# EAGLE design mcu_brd2 (EAGLE 7.7.0)
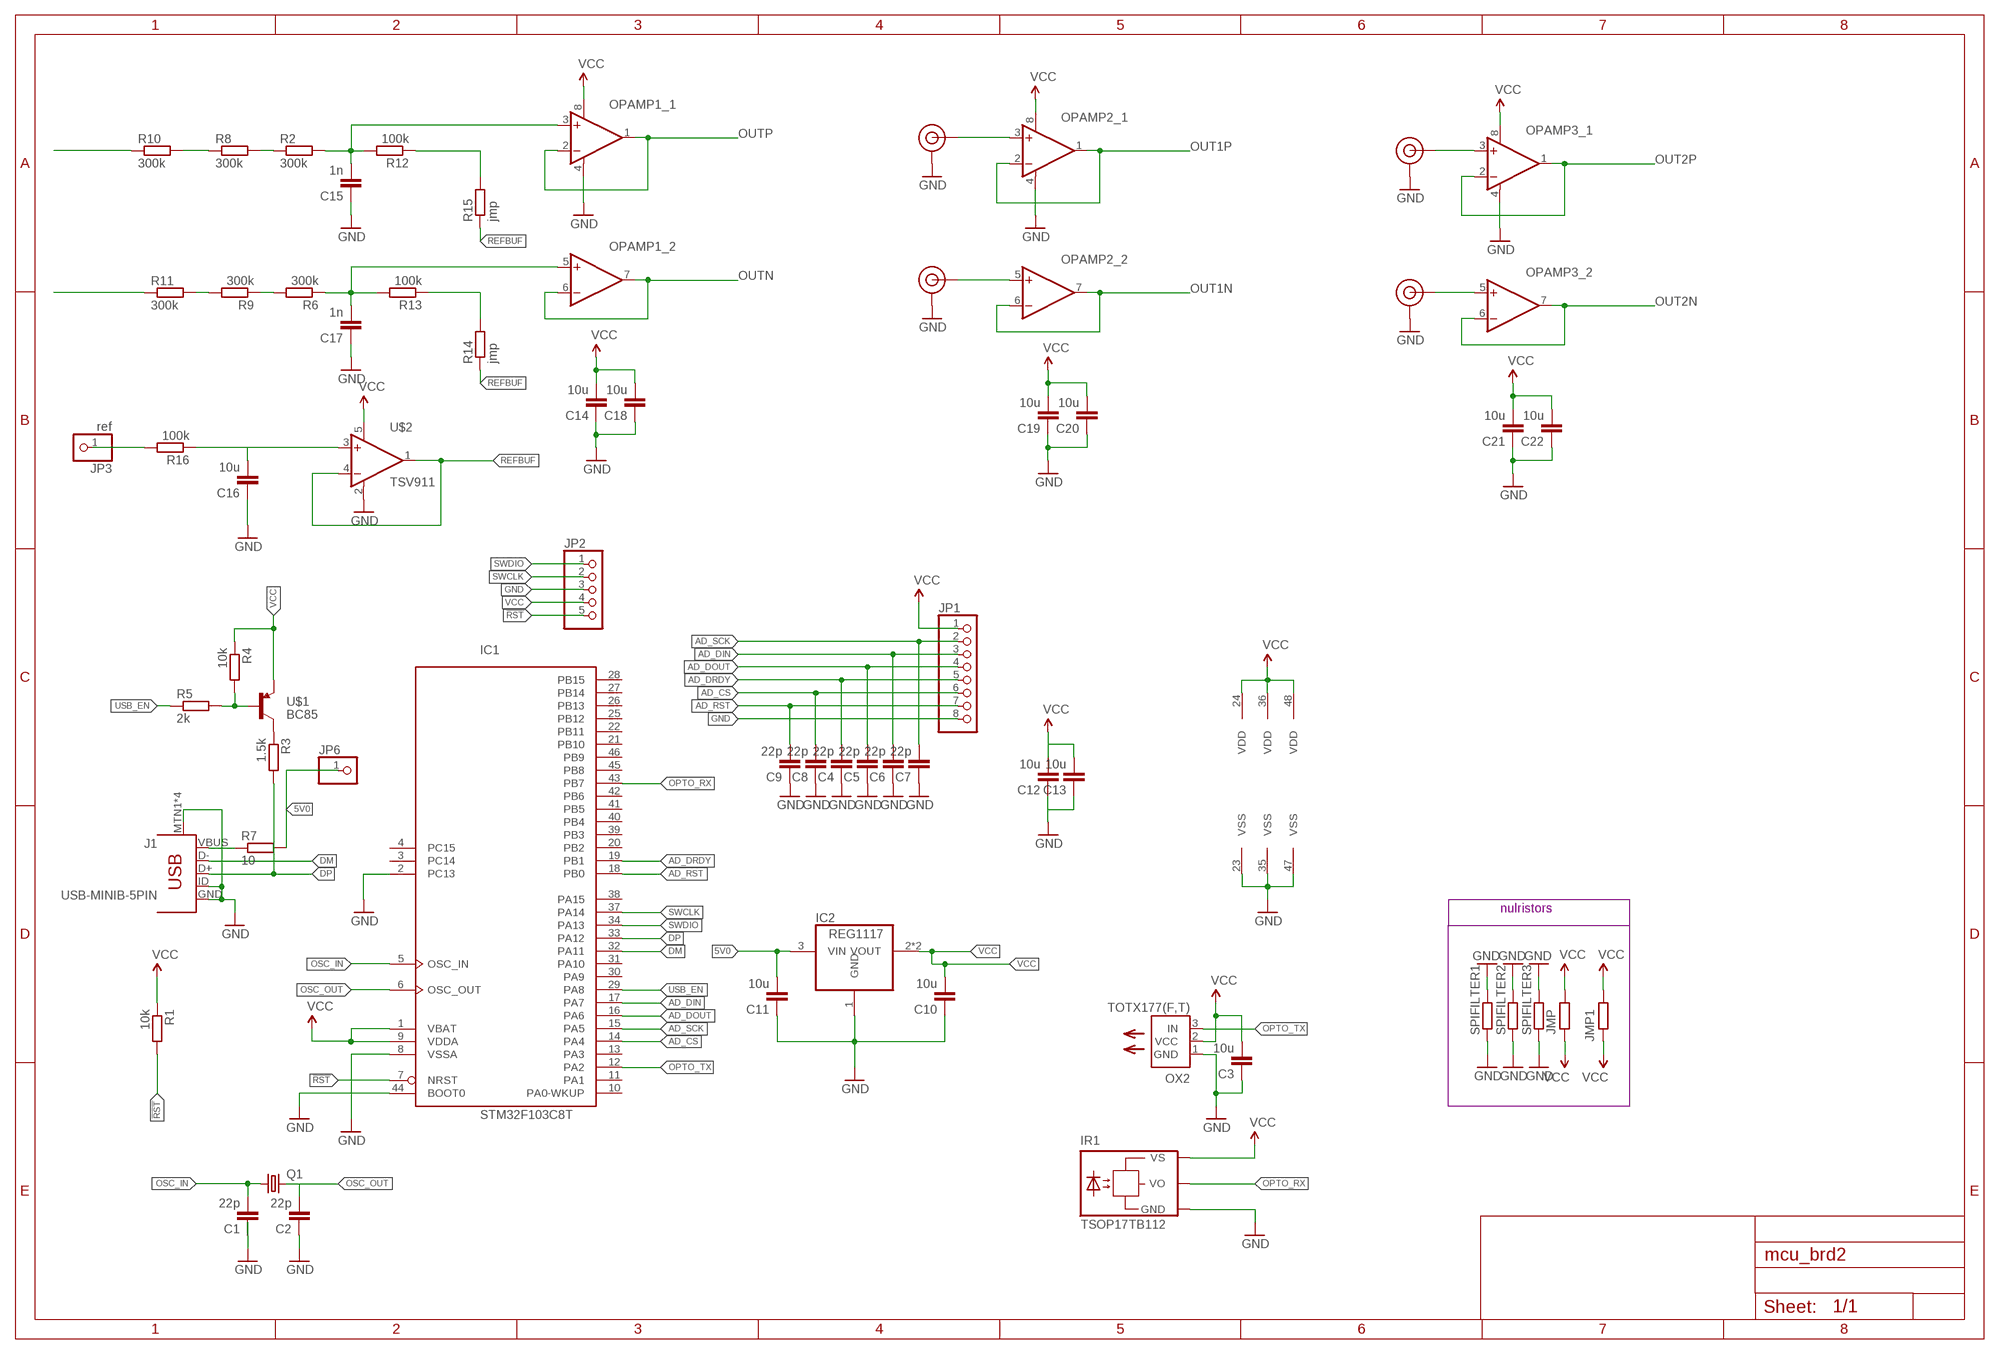
[diagram p0: schematic, sheet 1]

## Parts
C1  22p  CC0603  [C0603]
C2  22p  CC0603  [C0603]
C3  10u  CC0603  [C0603]
C4  22p  CC0603  [C0603]
C5  22p  CC0603  [C0603]
C6  22p  CC0603  [C0603]
C7  22p  CC0603  [C0603]
C8  22p  CC0603  [C0603]
C9  22p  CC0603  [C0603]
C10  10u  CC0805  [C0805]
C11  10u  CC0805  [C0805]
C12  10u  CC0805  [C0805]
C13  10u  CC0805  [C0805]
C14  10u  CC0805  [C0805]
C15  1n  CC0603  [C0603]
C16  10u  CC0805  [C0805]
C17  1n  CC0603  [C0603]
C18  10u  CC0805  [C0805]
C19  10u  CC0805  [C0805]
C20  10u  CC0805  [C0805]
C21  10u  CC0805  [C0805]
C22  10u  CC0805  [C0805]
IC1  STM32F103C8T  [LQFP48]
IC2  REG1117  [SOT223]
IR1  TSOP17TB112  [1X03]
J1  USB-MINIB-5PIN  [USB-MINIB]
J$1  SMA_EDGE  [SMA-EDGE]
J$2  SMA_EDGE  [SMA-EDGE]
J$3  SMA_EDGE  [SMA-EDGE]
J$4  SMA_EDGE  [SMA-EDGE]
JMP  R0603  [0603]
JMP1  R0603  [0603]
JP1  PINHD-1X8  [1X08]
JP2  PINHD-1X5  [1X05]
JP3  ref  PINHD-1X01_2.00  [1X01M]
JP6  PINHD-1X1  [1X01]
OPAMP1  LMC662  [SO08]
OPAMP2  LMC662  [SO08]
OPAMP3  LMC662  [SO08]
OX2  TOTX177(F,T)  [TOTX]
Q1  CRYSTALHC49UP  [HC49UP]
R1  10k  R0603  [0603]
R2  300k  R0603  [0603]
R3  1.5k  R0603  [0603]
R4  10k  R0603  [0603]
R5  2k  R0603  [0603]
R6  300k  R0603  [0603]
R7  10  R0805  [R0805]
R8  300k  R0603  [0603]
R9  300k  R0603  [0603]
R10  300k  R0603  [0603]
R11  300k  R0603  [0603]
R12  100k  R0603  [0603]
R13  100k  R0603  [0603]
R14  jmp  R0603  [0603]
R15  jmp  R0603  [0603]
R16  100k  R0603  [0603]
SPIFILTER1  R0603  [0603]
SPIFILTER2  R0603  [0603]
SPIFILTER3  R0603  [0603]
U$1  BC85  [SOT23]
U$2  TSV911  [SOT23-5L]

## Nets
5V0: C11.2 IC2.3(VIN) JP6.1 R7.2
!RST: IC1.7(NRST) JP2.5 R1.2
AD_CS: C8.2 IC1.14(PA4) JP1.6
AD_DIN: C6.2 IC1.17(PA7) JP1.3
AD_DOUT: C5.2 IC1.16(PA6) JP1.4
AD_DRDY: C4.2 IC1.19(PB1) JP1.5
AD_RST: C9.2 IC1.18(PB0) JP1.7
AD_SCK: C7.2 IC1.15(PA5) JP1.2
DM: IC1.32(PA11) J1.D-
DP: IC1.33(PA12) J1.D+ R3.2
GND: C1.1 C2.1 C3.1 C4.1 C5.1 C6.1 C7.1 C8.1 C9.1 C10.1 C11.1 C12.1 C13.1 C14.1 C15.1 C16.1 C17.1 C18.1 C19.1 C20.1 C21.1 C22.1 IC1.2(PC13) IC1.8(VSSA) IC1.23(VSS) IC1.35(VSS) IC1.44(BOOT0) IC1.47(VSS) IC2.1(GND) IR1.3(GND) J1.GND J1.ID J1.MTN1 J1.MTN2(MTN1) J1.MTN3(MTN1) J1.MTN4(MTN1) J$1.GND@0(GND) J$1.GND@1(GND) J$1.GND@2(GND) J$1.GND@3(GND) J$2.GND@0(GND) J$2.GND@1(GND) J$2.GND@2(GND) J$2.GND@3(GND) J$3.GND@0(GND) J$3.GND@1(GND) J$3.GND@2(GND) J$3.GND@3(GND) J$4.GND@0(GND) J$4.GND@1(GND) J$4.GND@2(GND) J$4.GND@3(GND) JP1.8 JP2.3 OPAMP1.4(_1:V-) OPAMP2.4(_1:V-) OPAMP3.4(_1:V-) OX2.1(GND) SPIFILTER1.1 SPIFILTER1.2 SPIFILTER2.1 SPIFILTER2.2 SPIFILTER3.1 SPIFILTER3.2 U$2.2(V-)
N$1: J$2.SIG(SIGNAL) OPAMP2.5(_2:+IN)
N$2: J$1.SIG(SIGNAL) OPAMP2.3(_1:+IN)
N$3: R3.1 U$1.3(C)
N$4: R4.2 R5.2 U$1.1(B)
N$5: J$4.SIG(SIGNAL) OPAMP3.5(_2:+IN)
N$6: C17.2 OPAMP1.5(_2:+IN) R6.1 R13.2
N$7: J$3.SIG(SIGNAL) OPAMP3.3(_1:+IN)
N$8: R12.1 R15.2
N$10: C15.2 OPAMP1.3(_1:+IN) R2.2 R12.2
N$11: R10.1
N$12: R6.2 R9.1
N$13: R2.1 R8.2
N$14: R9.2 R11.2
N$15: R11.1
N$16: R8.1 R10.2
N$17: JP3.1 R16.2
N$18: R13.1 R14.2
N$19: C16.2 R16.1 U$2.3(+IN)
OPTO_RX: IC1.43(PB7) IR1.1(VO)
OPTO_TX: IC1.12(PA2) OX2.3(IN)
OSC_IN: C1.2 IC1.5(OSC_IN) Q1.1
OSC_OUT: C2.2 IC1.6(OSC_OUT) Q1.2
OUT1N: OPAMP2.6(_2:-IN) OPAMP2.7(_2:OUT)
OUT1P: OPAMP2.1(_1:OUT) OPAMP2.2(_1:-IN)
OUT2N: OPAMP3.6(_2:-IN) OPAMP3.7(_2:OUT)
OUT2P: OPAMP3.1(_1:OUT) OPAMP3.2(_1:-IN)
OUTN: OPAMP1.6(_2:-IN) OPAMP1.7(_2:OUT)
OUTP: OPAMP1.1(_1:OUT) OPAMP1.2(_1:-IN)
REFBUF: R14.1 R15.1 U$2.1(OUT) U$2.4(-IN)
SWCLK: IC1.37(PA14) JP2.2
SWDIO: IC1.34(PA13) JP2.1
USB_EN: IC1.29(PA8) R5.1
VBUS: J1.VBUS R7.1
VCC: C3.2 C10.2 C12.2 C13.2 C14.2 C18.2 C19.2 C20.2 C21.2 C22.2 IC1.1(VBAT) IC1.9(VDDA) IC1.24(VDD) IC1.36(VDD) IC1.48(VDD) IC2.2(VOUT) IC2.4(VOUT) IR1.2(VS) JMP1.1 JMP1.2 JMP.1 JMP.2 JP1.1 JP2.4 OPAMP1.8(_1:V+) OPAMP2.8(_1:V+) OPAMP3.8(_1:V+) OX2.2(VCC) R1.1 R4.1 U$1.2(E) U$2.5(V+)
Unconnected: IC1.3(PC14) IC1.4(PC15) IC1.10(PA0-WKUP) IC1.11(PA1) IC1.13(PA3) IC1.20(PB2) IC1.21(PB10) IC1.22(PB11) IC1.25(PB12) IC1.26(PB13) IC1.27(PB14) IC1.28(PB15) IC1.30(PA9) IC1.31(PA10) IC1.38(PA15) IC1.39(PB3) IC1.40(PB4) IC1.41(PB5) IC1.42(PB6) IC1.45(PB8) IC1.46(PB9)

## Notes on the sheet
- nulristors

## Library data of the parts
C1-C22 = smalsmd:C: Capacitor
IC1 = micro-stm_v3:STM32F103C*T: ARM 32-bit Cortex™-M3 CPU 72 MHz maximum frequency 16 to 128 Kbytes of Flash memory 6 to 20 kbytes of SRAM 37 GPIOs 2.0 to 3.6 V application supply
IC2 = burr-brown:REG1117: 800mA and 1A Low Dropout (LDO) Positive Regulator 1.8V, 2.5V, 2.85V, 3.3V, 5V, and Adj; MPN: REG1117; OC_FARNELL: 1097566; OC_NEWARK: 14P6981
IR1 = telefunken:TSOP17*TB1: TSOP17..TB1 IR Receiver Modules for Remote Control Systems Source: http://www.vishay.com/docs/82042/82042.pdf
J1 = SparkFun-Connectors:USB-MINIB: Mini-USB "B" connector with 5th pin broken out. Created new symbol breaking out 5th "ID" pin in mini/micro USB connector spec. See: http://en.wikipedia.org/wiki/Mini_usb#Cables. Uses same footprint as 4-pin symbol. Also added pins to connect to mounting / shield pads if required (probably not generally needed as signals aren't shielded once they leave the connector).; PROD_ID: CONN-08193
J$1-J$4 = SparkFun-Connectors:SMA_EDGE: SMA Antenna Connector End launch SMA connector. The paste layer has been removed so that the connector can be hand soldered onto the board after reflow.
JMP JMP1 R1-R16 SPIFILTER1-SPIFILTER3 = smalsmd:R
JP1 = pinhead:PINHD-1X8: PIN HEADER
JP2 = pinhead:PINHD-1X5: PIN HEADER
JP3 = pinhead-2:PINHD-1X01: PIN HEADER
JP6 = pinhead:PINHD-1X1: PIN HEADER
OPAMP1-OPAMP3 = OU:LMC662
OX2 = toslink:TOTX177(F,T): FIBER OPTIC TRANSMITTING MODULE
Q1 = crystal:CRYSTAL: CRYSTAL; OC_FARNELL: unknown; OC_NEWARK: unknown
U$1 = smalsmd:BC85*
U$2 = OU:TSV911

## Board
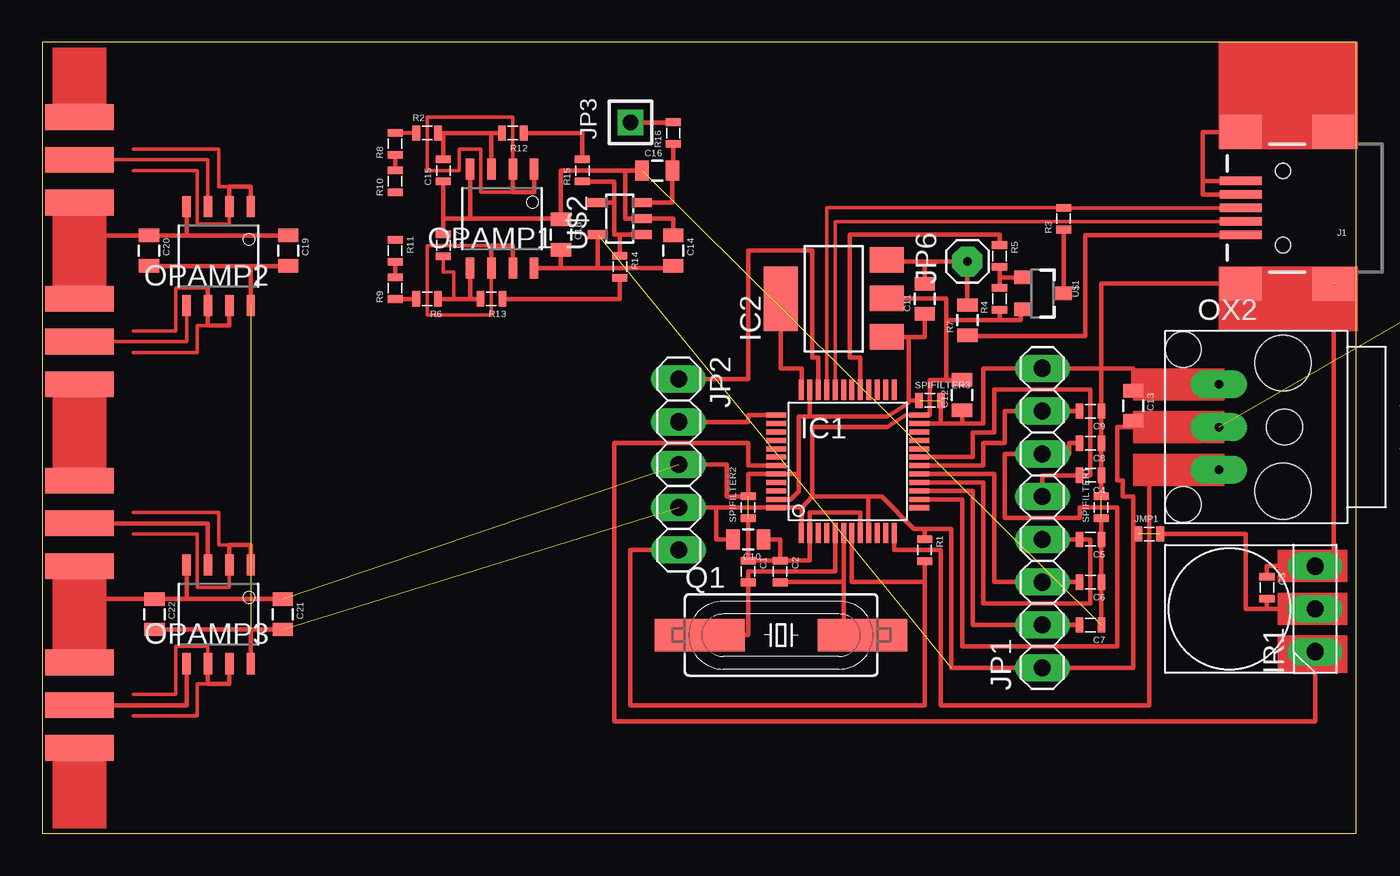
[diagram p1: board, top side]
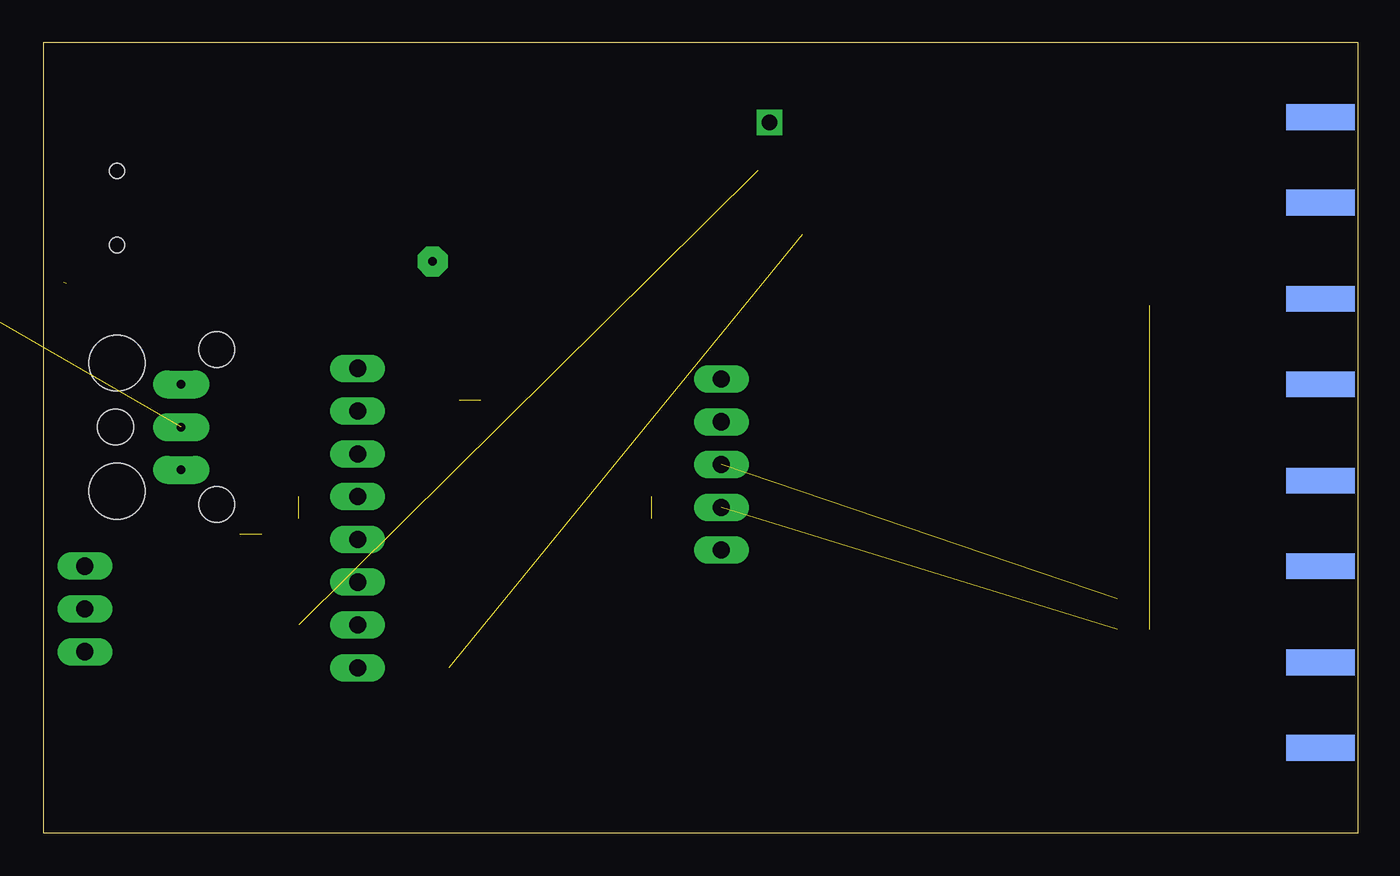
[diagram p2: board, bottom side, seen from below]

Size 78 x 47 mm. Coordinates in mm from the lower left corner, seen from the top.
Outline: 0,0 78,0 78,47 0,47 0,0
Copper layers (1*16): Top 0.035mm / dielectric 1.5mm / Bottom 0.035mm
Design rules "SparkFun": minimum track width 8mil, minimum drill 20mil, track to track 8mil, track to pad 8mil, pad to pad 8mil, via to via 8mil, smd to smd 8mil, copper to edge 10mil, drill to drill 8mil, minimum pad ring 12mil, minimum via ring 10mil, stop-mask expansion 4mil, vias tented up to drill 25mil, thermal gap 10mil

### Footprints (pad centres in the part's own frame; a part is rotated, then mirrored left to right if it is on the bottom)
C0603 = smd 0.45 x 0.9: 1 -0.65,0; 2 0.65,0
C0805 = smd 0.8 x 1.2: 1 -0.9,0; 2 0.9,0
LQFP48 = smd 0.3 x 1.2: 1 -2.75,-4.25; 2 -2.25,-4.25; 3 -1.75,-4.25; 4 -1.25,-4.25; 5 -0.75,-4.25; 6 -0.25,-4.25; 7 0.25,-4.25; 8 0.75,-4.25; 9 1.25,-4.25; 10 1.75,-4.25; 11 2.25,-4.25; 12 2.75,-4.25; 25 2.75,4.25; 26 2.25,4.25; 27 1.75,4.25; 28 1.25,4.25; 29 0.75,4.25; 30 0.25,4.25; 31 -0.25,4.25; 32 -0.75,4.25; 33 -1.25,4.25; 34 -1.75,4.25; 35 -2.25,4.25; 36 -2.75,4.25 | smd 1.2 x 0.3: 13 4.25,-2.75; 14 4.25,-2.25; 15 4.25,-1.75; 16 4.25,-1.25; 17 4.25,-0.75; 18 4.25,-0.25; 19 4.25,0.25; 20 4.25,0.75; 21 4.25,1.25; 22 4.25,1.75; 23 4.25,2.25; 24 4.25,2.75; 37 -4.25,2.75; 38 -4.25,2.25; 39 -4.25,1.75; 40 -4.25,1.25; 41 -4.25,0.75; 42 -4.25,0.25; 43 -4.25,-0.25; 44 -4.25,-0.75; 45 -4.25,-1.25; 46 -4.25,-1.75; 47 -4.25,-2.25; 48 -4.25,-2.75
SOT223 = smd 1.499 x 2.007: 1 -2.261,-3.15; 2 0.025,-3.15; 3 2.311,-3.15 | smd 3.81 x 2.007: 4 0,3.15
1X03 = drill 1.016 long: 1 -2.54,0; 2 0,0; 3 2.54,0
USB-MINIB = smd 2.5 x 0.5: D+ 2.5,0; D- 2.5,0.8; GND 2.5,-1.6; ID 2.5,-0.8; VBUS 2.5,1.6 | smd 2.5 x 2: MTN1 -3,4.5; MTN2 2.5,4.5; MTN3 -3,-4.5; MTN4 2.5,-4.5 | hole 0.9: 0,2.2; 0,-2.2
SMA-EDGE = smd 1.524 x 4.064: GND@0 0,0; GND@1 5.08,0; SIG 2.54,0 | smd 1.524 x 4.064 bottom: GND@2 0,0; GND@3 5.08,0
0603 = smd 0.45 x 0.9: 1 -0.65,0; 2 0.65,0
1X08 = drill 1.016 long: 1 -8.89,0; 2 -6.35,0; 3 -3.81,0; 4 -1.27,0; 5 1.27,0; 6 3.81,0; 7 6.35,0; 8 8.89,0
1X05 = drill 1.016 long: 1 -5.08,0; 2 -2.54,0; 3 0,0; 4 2.54,0; 5 5.08,0
1X01M = drill 0.914 square: 1 0,0
1X01 = drill 0.5 pad 1.778 octagon: 1 0,0
SO08 = smd 0.5 x 1.25: 1 -1.905,-2.934; 2 -0.635,-2.934; 3 0.635,-2.934; 4 1.905,-2.934; 5 1.905,2.934; 6 0.635,2.934; 7 -0.635,2.934; 8 -1.905,2.934
TOTX = drill 0.5 pad 1.676 long: 1 -3.81,2.54; 2 -3.81,0; 3 -3.81,-2.54 | hole 3.3: 0,-3.81; 0,3.81 | hole 2.1: 0.09,0; -5.91,4.6; -5.91,-4.6
HC49UP = smd 5.334 x 1.93: 1 -4.826,0; 2 4.826,0
R0805 = smd 0.8 x 1.2: 1 -0.9,0; 2 0.9,0
SOT23 = smd 0.8 x 1: 1 -0.95,-1.159; 2 0.95,-1.159; 3 0,1.259
SOT23-5L = smd 0.55 x 1.2: 1 -0.95,-1.3; 2 0,-1.3; 3 0.95,-1.3; 4 0.95,1.3; 5 -0.95,1.3

### Placement (x,y rotation side)
C1  41.91,15.56 270 top
C2  43.81,15.56 270 top
C3  72.71,14.61 270 top
C4  62.23,21.27 180 top
C5  62.23,17.46 180 top
C6  62.23,14.92 180 top
C7  62.23,12.38 180 top
C8  62.23,23.18 180 top
C9  62.23,25.08 180 top
C10  41.91,17.46 180 top
C11  52.39,31.75 90 top
C12  54.61,26.04 90 top
C13  64.77,25.4 270 top
C14  37.47,34.61 270 top
C15  23.81,39.37 90 top
C16  36.51,39.37 0 top
C17  23.81,34.92 270 top
C18  30.8,35.56 270 top
C19  14.61,34.61 270 top
C20  6.35,34.61 270 top
C21  14.29,13.02 270 top
C22  6.67,13.02 270 top
IC1  47.82,22.09 0 top
IC2  46.99,31.75 90 top
IR1  75.56,13.34 90 top
J1  73.66,37.15 180 top
J$1  2.22,42.55 270 top
J$2  2.22,31.75 270 top
J$3  2.22,20.95 270 top
J$4  2.22,10.16 270 top
JMP  87.95,35.24 90 top  (outside the outline)
JMP1  65.72,17.78 0 top
JP1  59.37,18.73 90 top
JP2  37.78,21.91 270 top
JP3  34.92,42.23 0 top
JP6  54.93,33.97 90 top
OPAMP1  27.3,36.51 180 top
OPAMP2  10.48,34.29 180 top
OPAMP3  10.48,13.02 180 top
OX2  73.66,24.13 0 top
Q1  43.87,11.79 0 top
R1  52.39,16.83 270 top
R2  22.86,41.59 0 top
R3  60.64,36.51 90 top
R4  56.83,31.75 90 top
R5  56.83,34.29 270 top
R6  22.86,31.75 180 top
R7  54.93,30.48 90 top
R8  20.95,40.96 90 top
R9  20.95,32.38 90 top
R10  20.95,38.73 90 top
R11  20.95,34.61 270 top
R12  27.94,41.59 180 top
R13  26.67,31.75 180 top
R14  34.29,33.66 270 top
R15  32.07,39.37 90 top
R16  37.47,41.59 90 top
SPIFILTER1  62.87,19.37 90 top
SPIFILTER2  41.91,19.37 90 top
SPIFILTER3  52.7,25.72 0 top
U$1  59.37,32.07 270 top
U$2  34.29,36.51 90 top

### Tracks (layer width: path | path; a pad name or v marks a point on that pad's centre or on a via)
5V0
  Top 0.2: IC2.3 49.82,33.97
  Top 0.254: 49.82,33.97 JP6.1 | JP6.1 52.39,33.97 C11.2 | JP6.1 R7.2
!RST
  Top 0.254: IC1.7 48.07,14.92 52.39,14.92 | 52.39,14.92 52.39,7.62 34.92,7.62 34.92,16.83 JP2.5 | R1.2 52.39,14.92
AD_CS
  Top 0.254: IC1.14 54.61,19.84 54.61,11.11 63.82,11.11 63.82,19.37 61.59,19.37 61.59,18.73 57.15,18.73 57.15,22.54 JP1.6 60.96,22.54 60.96,23.18 C8.2
AD_DIN
  Top 0.254: IC1.17 56.52,21.34 56.52,14.92 JP1.3 C6.2
AD_DOUT
  Top 0.254: IC1.16 55.88,20.84 55.88,13.65 62.23,13.65 62.23,17.46 C5.2 JP1.4
AD_DRDY
  Top 0.254: IC1.19 55.24,22.34 55.24,23.81 56.52,23.81 56.52,26.35 62.23,26.35 62.23,21.27 C4.2 59.37,21.27 JP1.5
AD_RST
  Top 0.254: IC1.18 55.88,21.84 55.88,23.18 57.15,23.18 57.15,25.08 JP1.7 C9.2
AD_SCK
  Top 0.254: IC1.15 55.24,20.34 55.24,12.38 JP1.2 C7.2
DM
  Top 0.2: IC1.32 47.07,36.35 J1.D-
DP
  Top 0.2: IC1.33 46.57,37.16 R3.2 60.64,37.15 J1.D+
GND  (6 unrouted)
  Top 0.2: 50.16,24.77 51.44,25.56 51.44,25.72 | 76.66,41.59 J1.MTN3 | OX2.1 64.77,26.67 64.77,26.99 | 41.91,18.1
  Top 0.254: C5.1 C6.1 C7.1 62.87,12.38 | C5.1 62.88,17.78 62.87,17.78 62.87,17.46 C5.1 | 45.56,24.77 IC1.35 45.56,26.36 | 45.56,24.77 50.16,24.77 | SPIFILTER1.2 62.87,21.26 C4.1 C8.1 C9.1 62.88,25.72 62.87,25.72 62.87,27.62 | SPIFILTER1.1 C5.1 | 44.93,21.34 44.93,20.32 44.45,19.84 IC1.47 | 44.93,21.34 44.93,24.77 45.56,24.77 | C2.1 42.23,16.21 C1.1 41.91,18.1 SPIFILTER2.1 | IC1.8 48.58,19.05 45.57,19.05 IC1.2 45.57,16.21 C2.1 | OPAMP1.4 25.4,36.51 | 25.4,36.51 30.8,36.51 | 34.61,39.37 30.8,39.37 30.8,36.51 | 34.61,39.37 34.61,36.51 U$2.2 37.47,36.51 C14.1 | C16.1 34.61,39.37 | 30.8,36.51 C18.1 | C17.1 23.81,36.51 | 23.81,36.51 25.4,36.51 | C15.1 23.81,36.51 | 44.93,21.34 IC1.44 41.91,21.34 SPIFILTER2.2 41.91,20 40.64,20 40.64,21.91 JP2.3 | 62.87,27.62 JP1.8 55.88,27.62 55.88,24.34 54.61,24.34 | J1.GND 68.9,38.75 | 68.9,38.75 68.9,37.95 J1.ID | J1.MTN4 68.9,41.65 68.9,38.75 | 51.44,29.49 51.44,25.72 SPIFILTER3.1 | C11.1 52.39,29.49 51.44,29.49 | 51.44,29.49 IC2.1 | IC1.23 53.35,24.34 | 53.35,24.34 SPIFILTER3.2 | C12.1 54.61,24.34 | 53.35,24.34 54.61,24.34 | 62.87,27.62 64.77,27.62 64.77,26.99 C13.1 | 76.66,15.88 IR1.3 72.71,15.88 C3.1 | C10.1 43.81,17.46 C2.1 | 62.87,27.62 62.87,32.65 J1.MTN1 76.66,15.88 | 76.98,15.88 76.66,15.88 | 8.57,35.51 C20.1 2.22,35.51 | 8.57,35.51 C19.1 | OPAMP2.4 8.57,35.51 | 8.57,13.92 C22.1 2.22,13.92 | 8.57,13.92 C21.1 | OPAMP3.4 8.57,13.92 | J$1.GND@1 2.22,35.51 | 2.22,35.51 J$2.GND@0 | J$2.GND@1 J$3.GND@0 | J$3.GND@1 2.22,13.92 | 2.22,13.92 J$4.GND@0
  Top 0.61: 76.83,32.7 75.71,32.7
N$1
  Top 0.2: OPAMP2.5 8.57,29.53 8.57,29.21 J$2.SIG
N$2
  Top 0.2: OPAMP2.3 9.84,40.01 J$1.SIG
N$3
  Top 0.254: U$1.3 60.64,32.07 R3.1
N$4
  Top 0.2: U$1.1 58.1,33.02
  Top 0.254: R5.2 56.83,33.02 | 56.83,33.02 R4.2 | 58.1,33.02 56.83,33.02
N$5
  Top 0.254: OPAMP3.5 8.57,7.62 J$4.SIG
N$6
  Top 0.2: C17.2 23.81,33.34 24.45,33.34 24.45,31.75
  Top 0.254: R6.1 24.45,31.75 25.4,31.75 | OPAMP1.5 25.4,31.75 | 25.4,31.75 R13.2
N$7
  Top 0.254: OPAMP3.3 9.84,18.41 J$3.SIG
N$8
  Top 0.254: R12.1 32.07,41.59 R15.2
N$10
  Top 0.254: 23.81,41.59 26.67,41.59 | OPAMP1.3 26.67,41.59 | R12.2 26.67,41.59 | R2.2 23.81,41.59 | 23.81,41.59 C15.2
N$12
  Top 0.254: R9.1 R6.2
N$13
  Top 0.254: R8.2 R2.1
N$14
  Top 0.254: R11.2 R9.2
N$16
  Top 0.254: R10.2 R8.1
N$17
  Top 0.254: JP3.1 37.47,42.23 R16.2
N$18
  Top 0.254: R13.1 34.29,31.75 R14.2
N$19
  Top 0.254: R16.1 37.47,39.37 C16.2 37.41,37.46 U$2.3
OPTO_RX
  Top 0.254: IC1.43 41.91,21.84 41.91,23.18 33.97,23.18 33.97,6.67 75.56,6.67 IR1.1
OPTO_TX
  Top 0.2: 65.72,21.59 OX2.3
  Top 0.254: IC1.12 50.57,16.83 53.34,16.83 53.34,7.62 65.72,7.62 65.72,21.59
OSC_IN
  Top 0.254: IC1.5 47.07,15.56 41.91,15.56 41.91,15.54 C1.2 41.91,11.79 Q1.1
OSC_OUT
  Top 0.254: IC1.6 47.57,14.92 | 47.57,14.92 47.57,12.1 Q1.2 | C2.2 43.81,14.92 47.57,14.92
OUT1N
  Top 0.2: 9.84,32.38 7.94,32.38 7.94,29.84 5.4,29.84 | 9.84,30.16 9.21,30.16 9.21,28.57 5.4,28.57
  Top 0.254: 9.84,32.38 OPAMP2.6 9.84,30.16 11.11,30.16 OPAMP2.7
OUT1P
  Top 0.2: 5.4,39.37 9.21,39.37 9.21,36.2 11.11,36.2 OPAMP2.2 | 11.11,38.42 10.48,38.42 10.48,40.64 5.4,40.64
  Top 0.254: OPAMP2.2 11.11,38.42 12.38,38.42 OPAMP2.1
OUT2N
  Top 0.2: 5.4,6.99 9.21,6.99 9.21,8.89 9.84,8.89 | OPAMP3.6 9.84,11.11 7.94,11.11 7.94,8.26 5.4,8.26
  Top 0.254: OPAMP3.7 11.11,8.89 9.84,8.89 OPAMP3.6
OUT2P
  Top 0.2: OPAMP3.2 11.11,14.61 9.21,14.61 9.21,17.78 5.4,17.78 | 5.4,19.05 10.48,19.05 10.48,17.14 11.11,17.14
  Top 0.254: OPAMP3.1 12.38,17.14 11.11,17.14 OPAMP3.2
OUTN
  Top 0.2: 26.67,34.92 22.86,34.92 22.86,30.8 26.67,30.8 26.67,33.66
  Top 0.254: OPAMP1.6 26.67,33.66 26.67,34.92 27.94,34.92 OPAMP1.7
OUTP
  Top 0.2: 27.94,38.1 26.04,38.1 26.04,40.64 24.77,40.64 24.77,39.37 22.86,39.37 22.86,42.55 27.94,42.55 OPAMP1.2
  Top 0.254: OPAMP1.1 29.21,38.1 27.94,38.1 OPAMP1.2
REFBUF
  Top 0.254: U$2.1 34.29,35.56 | 34.29,35.56 33.97,35.56 33.97,37.47 | 33.97,37.47 U$2.4 32.7,37.46 | 33.97,37.47 33.97,38.72 R15.1 | R14.1 34.29,35.56
SWCLK
  Top 0.254: IC1.37 41.91,24.84 41.91,24.45 JP2.2
SWDIO
  Top 0.254: JP2.1 41.91,26.99 41.91,34.61 45.72,34.61 45.72,28.26 46.07,28.26 IC1.34
USB_EN
  Top 0.254: IC1.29 48.58,28.26 47.94,28.26 47.94,35.56 56.83,35.56 R5.1
VBUS
  Top 0.2: R7.1 54.93,29.53 | J1.VBUS | 61.91,35.55 61.91,35.56
  Top 0.254: 54.93,29.53 61.91,29.53 61.91,35.55 J1.VBUS
VCC  (6 unrouted)
  Top 0.2: IC1.24 51.28,24.84 50.16,24.13 | 38.1,19.34 JP2.4 | U$1.2 58.1,31.12 | OX2.2 64.77,24.13 | JMP1.1 64.77,17.78
  Top 0.254: 49.05,20 49.05,17.86 IC1.9 | 45.09,19.33 45.72,20 | 45.09,19.33 45.09,17.86 IC1.1 | 45.09,19.33 45.07,19.34 IC1.48 40.01,19.34 | 50.16,24.13 45.72,24.13 45.71,20 45.72,20 | IC1.36 45.09,26.36 45.09,27.62 43.84,27.62 IC2.4 | 52.39,18.1 53.98,18.1 53.98,9.84 JP1.1 64.77,9.84 64.77,17.78 64.77,20 64.14,20 64.14,20.95 63.82,20.95 63.82,24.13 64.77,24.13 C13.2 | 52.39,18.1 51.75,18.1 49.85,20 49.05,20 | 49.05,20 45.72,20 | OPAMP1.8 30.8,33.58 | 30.8,33.58 32.99,33.58 | 32.99,33.58 U$2.5 | 32.99,33.58 37.47,33.58 C14.2 | C18.2 30.8,33.58 | 40.01,19.34 38.1,19.34 | R4.1 56.83,30.48 | 56.83,30.48 53.66,30.48 | 58.1,31.12 58.1,30.48 56.83,30.48 | IC2.2 53.66,31.77 53.66,30.48 | IC1.24 52.7,24.84 52.7,26.93 53.66,26.93 | C12.2 53.66,26.93 | 53.66,30.48 53.66,26.93 | IR1.2 72.71,13.34 | 72.71,13.34 71.44,13.34 71.44,17.78 JMP1.2 | C3.2 72.71,13.34 | C10.2 40.01,17.46 40.01,19.34 | R1.1 52.39,18.1 | C19.2 12.38,33.71 | 12.38,33.71 C20.2 | OPAMP2.8 12.38,33.71 | C22.2 12.38,12.12 | 12.38,12.12 C21.2 | OPAMP3.8 12.38,12.12
(copper drawn outside any net)
  shapes: Top area x13